# EAGLE design VCF-LM324-Stereo+LFO-POT2x3 (EAGLE 7.2.0)
Voltage-Controlled Low-Pass Filter with LFO using LM324 Quad-Opamp (Stereo) http://electro-music.com/forum/topic-45231-0.html&postdays=0&postorder=asc&highlight=
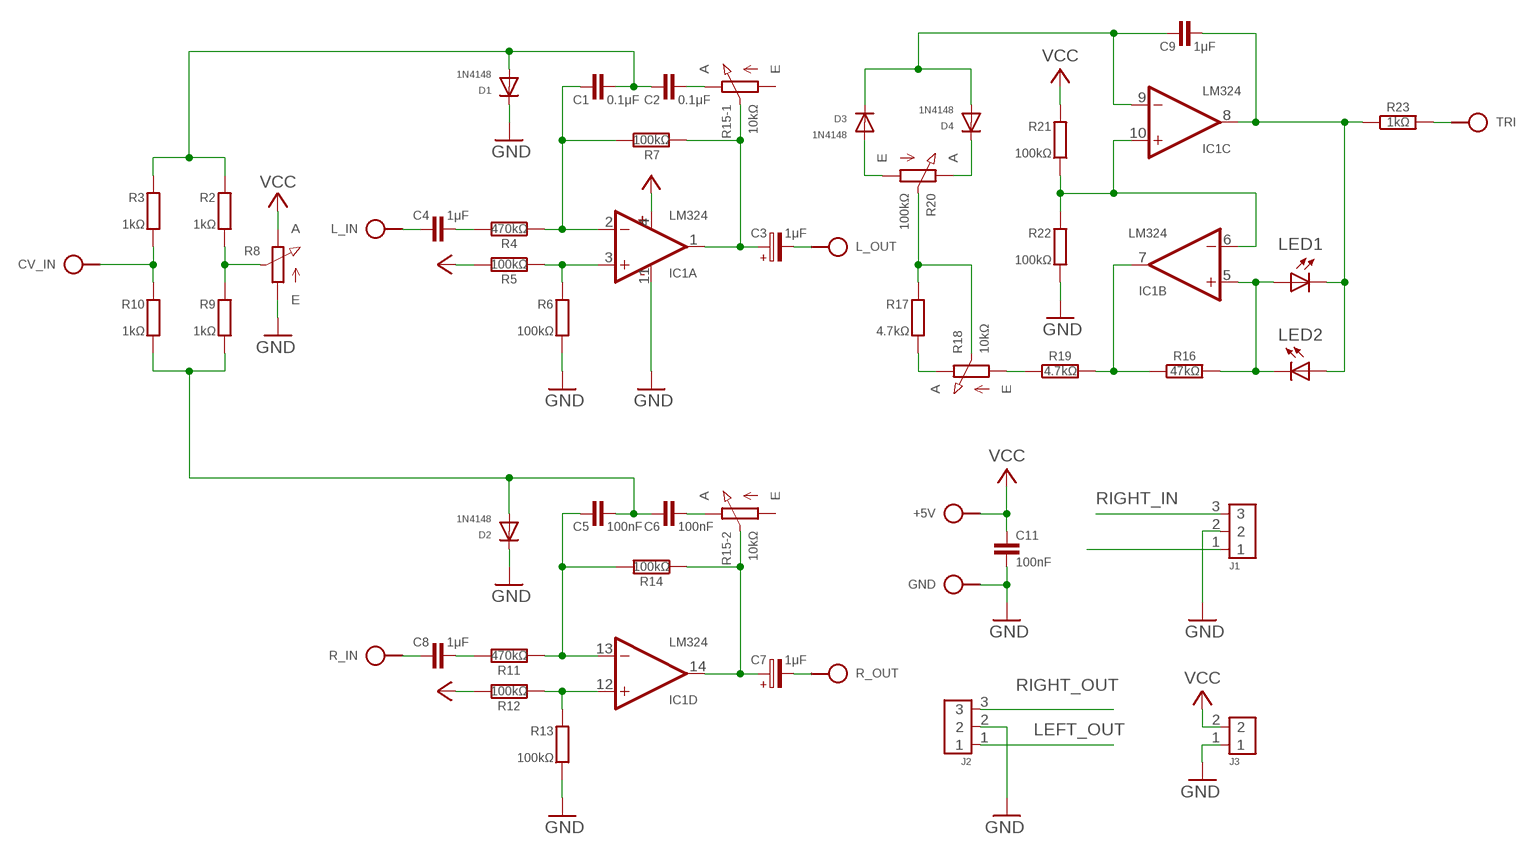
[diagram p0: schematic, sheet 1]

## Parts
+5V  VCC  SPAD  [SPAD]
C1  0.1μF  C-H075-020X044/V  [C075-020X044/V]
C2  0.1μF  C-H050-020X044  [C050-020X044]
C3  1μF  CPOL-HE2,5-3/V  [E2,5-3/V]
C4  1μF  C-H050-020X044  [C050-020X044]
C5  100nF  C-H050-020X044  [C050-020X044]
C6  100nF  C-H050-020X044  [C050-020X044]
C7  1μF  CPOL-HE2,5-3/V  [E2,5-3/V]
C8  1μF  C-H050-020X044  [C050-020X044]
C9  1μF  C-H050-024X044  [C050-024X044]
C11  100nF  C050-020X044  [C050-020X044]
CV_IN  CV_IN  SPAD  [SPAD]
D1  1N4148  1N414834-7V  [DO34-7V]
D2  1N4148  1N414834-7V  [DO34-7V]
D3  1N4148  1N414834-7V  [DO34-7V]
D4  1N4148  1N414834-7V  [DO34-7V]
GND  GND  SPAD  [SPAD]
IC1  LM324  LM324N  [DIL14]
J1  A_IN  CONN-3P-3P  [CONN-3P]
J2  A_OUT  CONN-3P-3P  [CONN-3P]
J3  CONN-2P2P/H  [CONN-2P]
L_IN  AUDIO_IN  SPAD  [SPAD]
L_OUT  AUDIO_OUT  SPAD  [SPAD]
LED1  LED3MM  [LED3MM]
LED2  LED3MM  [LED3MM]
R2  1kΩ  R0204V  [0204V]
R3  1kΩ  R0204/7  [0204/7]
R4  470kΩ  R-H0204/10-V  [0204/10-V]
R5  100kΩ  R-H0204/2V  [0204/2V]
R6  100kΩ  R0204/10  [0204/10]
R7  100kΩ  R0204/7-V  [0204/7-V]
R8  POT-P5  [POT-P5]
R9  1kΩ  R0204/10  [0204/10]
R10  1kΩ  R0204/10  [0204/10]
R11  470kΩ  R-H0204/15  [0204/15]
R12  100kΩ  R-H0204/7-V  [0204/7-V]
R13  100kΩ  R0202V  [0202V]
R14  100kΩ  R-H0204/2V  [0204/2V]
R15  10kΩ  POT-STEREO  [POT-STEREO-2X3]
R16  47kΩ  R-H0204/10  [0204/10]
R17  4.7kΩ  R0204/10  [0204/10]
R18  10kΩ  POT  [POT]
R19  4.7kΩ  R-H0204/10-V  [0204/10-V]
R20  100kΩ  POT  [POT]
R21  100kΩ  R0204/10-V  [0204/10-V]
R22  100kΩ  R0204/2V  [0204/2V]
R23  1kΩ  R-H0204/10  [0204/10]
R_IN  AUDIO_IN  SPAD  [SPAD]
R_OUT  AUDIO_OUT  SPAD  [SPAD]
TRI  TRIANGLE  SPAD  [SPAD]

## Nets
GND: C11.2 D1.C D2.C GND.1 IC1.11(P:V-) J1.2 J2.2 J3.1 R6.1 R8.A R13.1 R22.1
LEFT_IN: C4.1 J1.1 L_IN.1
LEFT_OUT: C3.- J2.1 L_OUT.1
N$1: C6.2 R15.2-E(-2:E)
N$2: C1.1 IC1.2(A:-IN) R4.1 R7.1
N$3: C2.2 R15.1-E(-1:E)
N$4: C3.+ IC1.1(A:OUT) R7.2 R15.1-S(-1:S)
N$5: R2.1 R8.S R9.2
N$7: IC1.3(A:+IN) R5.1 R6.2
N$8: CV_IN.1 R3.1 R10.2
N$9: C1.2 C2.1 D1.A R2.2 R3.2
N$10: C4.2 R4.2
N$12: C7.+ IC1.14(D:OUT) R14.1 R15.2-S(-2:S)
N$13: IC1.12(D:+IN) R12.1 R13.2
N$14: IC1.7(B:OUT) R16.1 R19.2
N$15: IC1.5(B:+IN) LED1.A LED2.K(C) R16.2
N$16: C5.2 C6.1 D2.A R9.1 R10.1
N$17: C5.1 IC1.13(D:-IN) R11.1 R14.2
N$20: C8.2 R11.2
N$26: C9.1 D3.C D4.A IC1.9(C:-IN)
N$28: C9.2 IC1.8(C:OUT) LED1.K(C) LED2.A R23.1
OA_C_IN+: IC1.6(B:-IN) IC1.10(C:+IN) R21.2 R22.2
RIGHT_IN: C8.1 J1.3 R_IN.1
RIGHT_OUT: C7.- J2.3 R_OUT.1
TRI_OUT: R23.2 TRI.1
TRIM_1_A: D3.A R20.1(A)
TRIM_1_B: D4.C R20.3(E)
TRIM_2_A: R17.1 R18.3(E)
TRIM_2_B: R18.1(A) R19.1
TRIM_P: R17.2 R18.2(S) R20.2(S)
VCC: +5V.1 C11.1 IC1.4(P:V+) J3.2 R5.2 R8.E R12.2 R21.1
Unconnected: R15.1-A(-1:A) R15.2-A(-2:A)

## Library data of the parts
+5V CV_IN GND L_IN L_OUT R_IN R_OUT TRI = pad:SPAD
C1 C2 C4-C6 C8 C9 = c:C-H
C3 C7 = c:CPOL-H
C11 = c:C: CAPACITOR, European symbol
D1-D4 = d:1N4148
IC1 = ic:LM324: OP AMP
J1 J2 = pinconn:CONN-3P
J3 = pinconn:CONN-2P
LED1 LED2 = led:LED: LED OSRAM: - CHIPLED LG R971, LG N971, LY N971, LG Q971, LY Q971, LO R971, LY R971 LH N974, LH R974 LS Q976, LO Q976, LY Q976 LO Q996 - Hyper CHIPLED LW Q18S LB Q993, LB Q99A, LB R99A - SideLED LS A670, LO A670, LY A670, LG A670, LP A670 LB A673, LV A673, LT A673, LW A673 LH A674 LY A675 LS A676, LA A676, LO A676, LY A676, LW A676 LS A679, LY A679, LG A679 - Hyper Micro SIDELED@@ LS Y876, LA Y876, LO Y876, LY Y876 LT Y87S - SmartLED LW L88C, LW L88S LB L89C, LB L89S, LG L890 LS L89K, LO L89K, LY L89K LS L896, LA L896, LO L896, LY L896 - TOPLED LS T670, LO T670, LY T670, LG T670, LP T670 LSG T670, LSP T670, LSY T670, LOP T670, LYG T670 LG T671, LOG T671, LSG T671 LB T673, LV T673, LT T673, LW T673 LH T674 LS T676, LA T676, LO T676, LY T676, LB T676, LH T676, LSB T676, LW T676 LB T67C, LV T67C, LT T67C, LS T67K, LO T67K, LY T67K, LW E67C LS E67B, LA E67B, LO E67B, LY E67B, LB E67C, LV E67C, LT E67C LW T67C LS T679, LY T679, LG T679 LS T770, LO T770, LY T770, LG T770, LP T770 LB T773, LV T773, LT T773, LW T773 LH T774 LS E675, LA E675, LY E675, LS T675 LS T776, LA T776, LO T776, LY T776, LB T776 LHGB T686 LT T68C, LB T68C - Hyper Mini TOPLED@@ LB M676 - Mini TOPLED Santana@@ LG M470 LS M47K, LO M47K, LY M47K Source: http://www.osram.convergy.de LUXEON: - LUMILED@@ LXK2-PW12-R00, LXK2-PW12-S00, LXK2-PW14-U00, LXK2-PW14-V00 LXK2-PM12-R00, LXK2-PM12-S00, LXK2-PM14-U00 LXK2-PE12-Q00, LXK2-PE12-R00, LXK2-PE12-S00, LXK2-PE14-T00, LXK2-PE14-U00 LXK2-PB12-K00, LXK2-PB12-L00, LXK2-PB12-M00, LXK2-PB14-N00, LXK2-PB14-P00, LXK2-PB14-Q00 LXK2-PR12-L00, LXK2-PR12-M00, LXK2-PR14-Q00, LXK2-PR14-R00 LXK2-PD12-Q00, LXK2-PD12-R00, LXK2-PD12-S00 LXK2-PH12-R00, LXK2-PH12-S00 LXK2-PL12-P00, LXK2-PL12-Q00, LXK2-PL12-R00 Source: www.luxeon.com KINGBRIGHT: KA-3528ASYC Source: www.kingbright.com
R2 R3 R6 R7 R9 R10 R13 R17 R21 R22 = r:R: RESISTOR, European symbol
R4 R5 R11 R12 R14 R16 R19 R23 = r:R-H
R8 R18 R20 = r:POT
R15 = r:POT-STEREO

## Module LFO
Ports: TRI_OUT(io) GND(io) VCC(io)

### Library data of the parts

## Module VCF-L
Ports: 

### Library data of the parts

## Board
Voltage-Controlled Low-Pass Filter with LFO using LM324 Quad-Opamp (Stereo) http://electro-music.com/forum/topic-45231-0.html&postdays=0&postorder=asc&highlight=
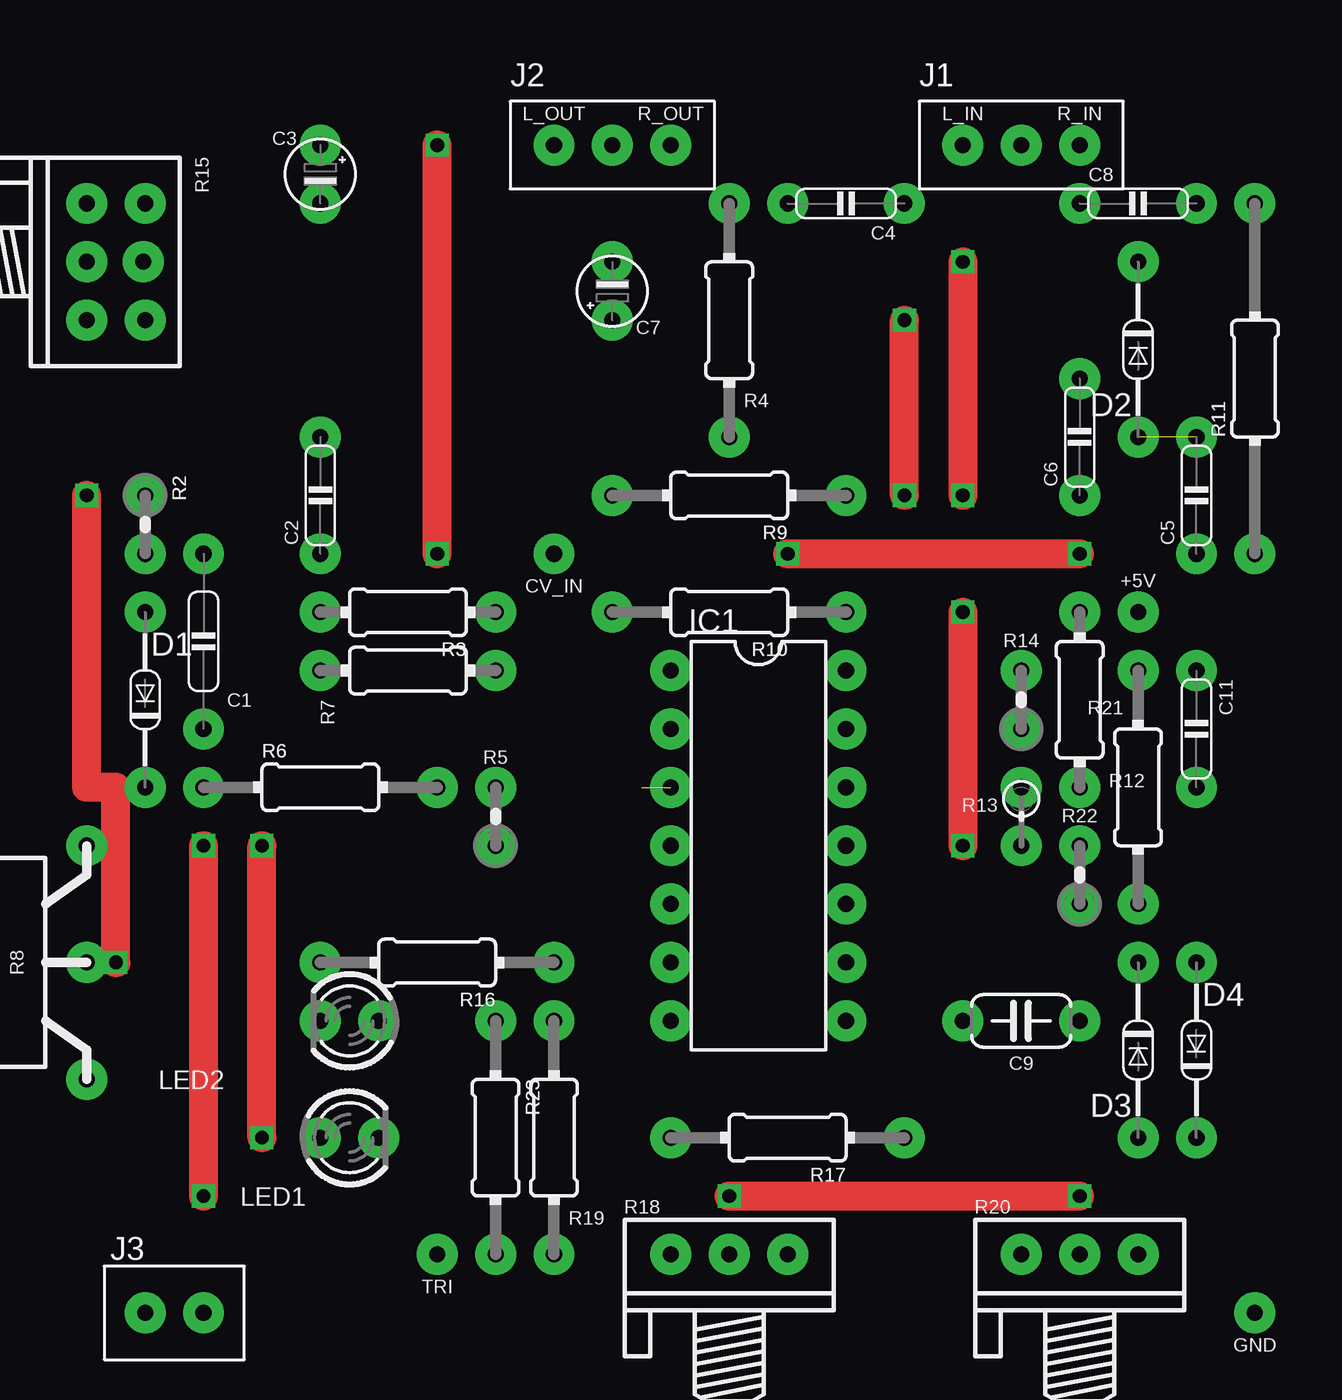
[diagram p1: board, top side]
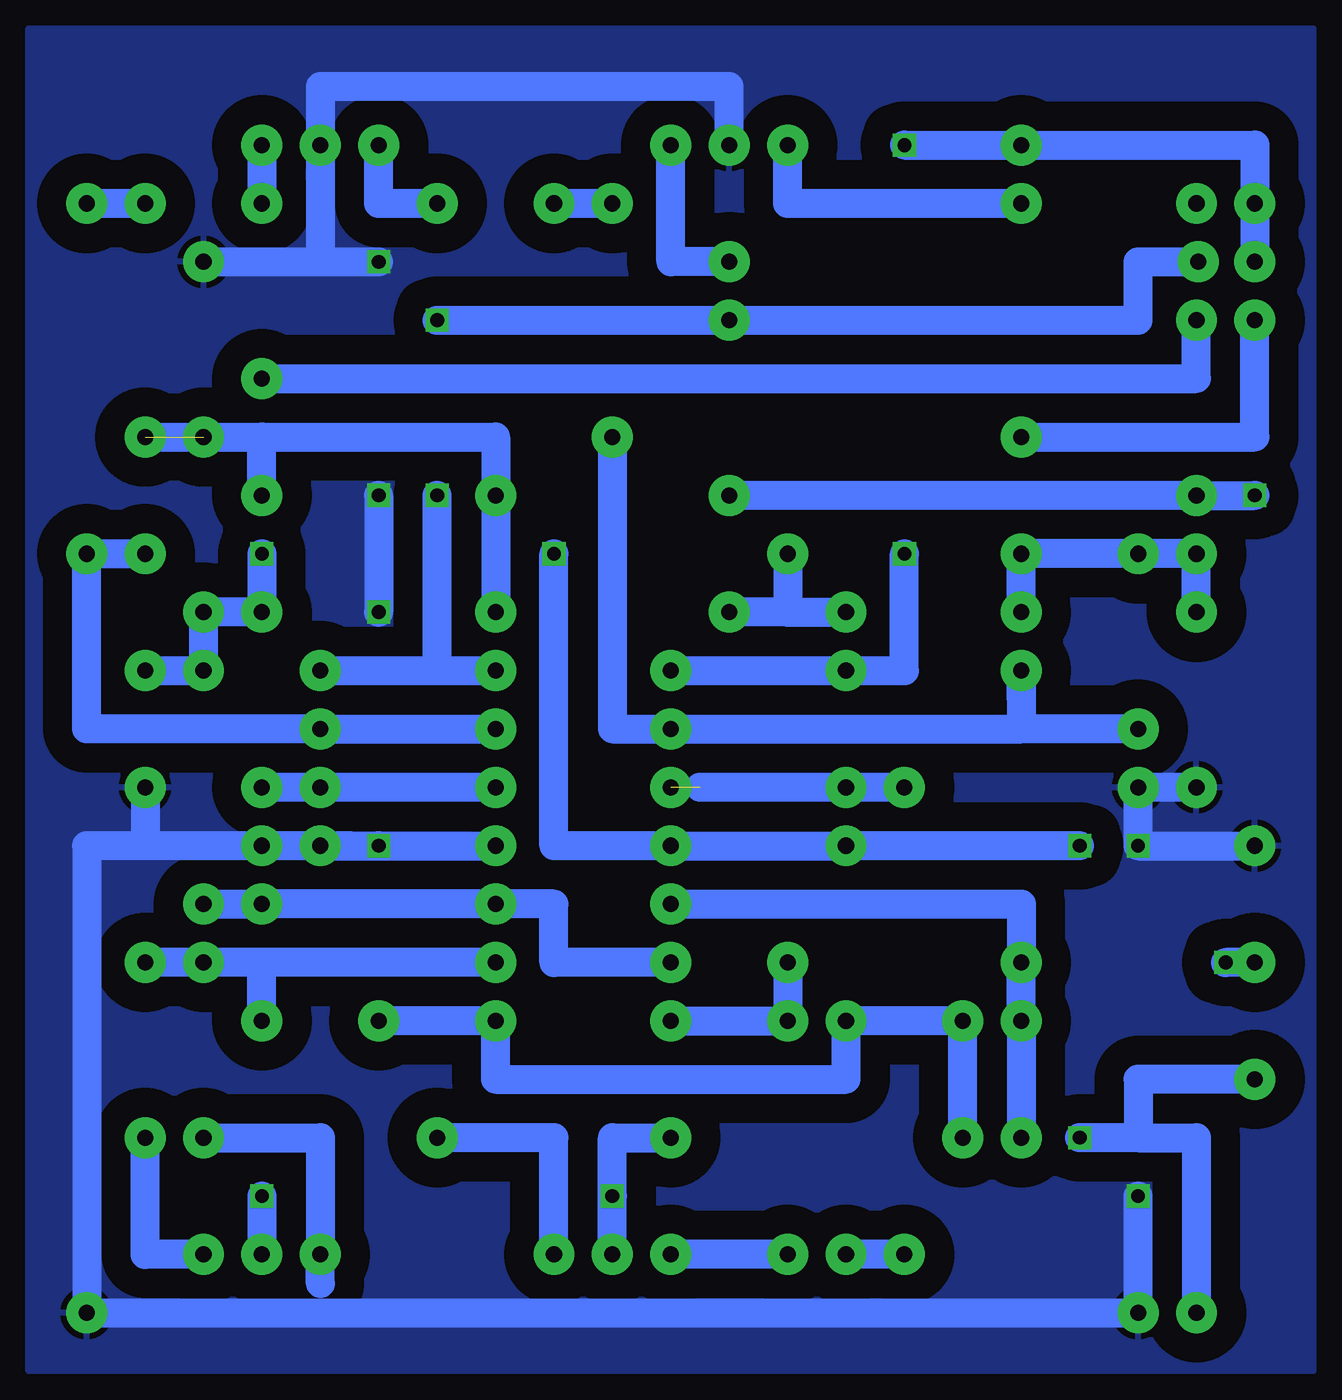
[diagram p2: board, bottom side, seen from below]

No outline drawn. Coordinates in mm, seen from the top.
Copper layers (1*16): Top 0.035mm / dielectric 1.5mm / Bottom 0.035mm
Design rules "default *": minimum track width 10mil, minimum drill 24mil, track to track 8mil, track to pad 8mil, pad to pad 8mil, via to via 8mil, smd to smd 8mil, copper to edge 40mil, drill to drill 8mil, minimum pad ring 10mil, minimum via ring 8mil, stop-mask expansion 0mil, vias tented up to drill 0mil, thermal gap 10mil

### Footprints (pad centres in the part's own frame; a part is rotated, then mirrored left to right if it is on the bottom)
SPAD = drill 0.7 pad 1.778: 1 0,0
C075-020X044/V = drill 0.7 pad 1.778: 1 0,3.81; 2 0,-3.81
C050-020X044 = drill 0.7 pad 1.778: 1 -2.54,0; 2 2.54,0
E2,5-3/V = drill 0.7 pad 1.778: + 0,1.27; - 0,-1.27
C050-024X044 = drill 0.7 pad 1.778: 1 -2.54,0; 2 2.54,0
DO34-7V = drill 0.7 pad 1.778: A 0,3.81; C 0,-3.81
DIL14 = drill 0.7 pad 1.778: 1 -3.81,7.62; 2 -3.81,5.08; 3 -3.81,2.54; 4 -3.81,0; 5 -3.81,-2.54; 6 -3.81,-5.08; 7 -3.81,-7.62; 8 3.81,-7.62; 9 3.81,-5.08; 10 3.81,-2.54; 11 3.81,0; 12 3.81,2.54; 13 3.81,5.08; 14 3.81,7.62
CONN-3P = drill 0.7 pad 1.778: 1 0,0; 2 2.54,0; 3 5.08,0
CONN-2P = drill 0.7 pad 1.778: 1 0,0; 2 -2.54,0
LED3MM = drill 0.7 pad 1.778: A -1.27,0; K 1.27,0
0204V = drill 0.7 pad 1.778: 1 -1.27,0; 2 1.27,0
0204/7 = drill 0.7 pad 1.778: 1 -3.81,0; 2 3.81,0
0204/10-V = drill 0.7 pad 1.778: 1 0,5.08; 2 0,-5.08
0204/2V = drill 0.7 pad 1.778: 1 0,1.27; 2 0,-1.27
0204/10 = drill 0.7 pad 1.778: 1 -5.08,0; 2 5.08,0
0204/7-V = drill 0.7 pad 1.778: 1 0,3.81; 2 0,-3.81
POT-P5 = drill 0.7 pad 1.778: A -5.08,2.54; E 5.08,2.54; S 0,2.54
0204/15 = drill 0.7 pad 1.778: 1 -7.62,0; 2 7.62,0
0202V = drill 0.7 pad 1.778: 1 0,-1.27; 2 0,1.27
POT-STEREO-2X3 = drill 0.7 pad 1.778: 1-A -2.54,-2.54; 1-E 2.54,-2.54; 1-S 0,-2.54; 2-A -2.54,0; 2-E 2.54,0; 2-S 0,-0.08
POT = drill 0.7 pad 1.778: 1 -2.54,0; 2 0,0; 3 2.54,0

### Placement (x,y rotation side)
+5V  50.8,33.02 270 top
C1  10.16,31.75 180 top
C2  15.24,38.1 90 top
C3  15.24,52.07 0 top
C4  38.1,50.8 180 top
C5  53.34,38.1 90 top
C6  48.26,40.64 90 top
C7  27.94,46.99 180 top
C8  50.8,50.8 0 top
C9  45.72,15.24 180 top
C11  53.34,27.94 270 top
CV_IN  25.4,35.56 90 top
D1  7.62,29.21 0 top
D2  50.8,44.45 180 top
D3  50.8,13.97 180 top
D4  53.34,13.97 0 top
GND  55.88,2.54 90 top
IC1  34.29,22.86 0 top
J1  43.18,53.34 0 top
J2  25.4,53.34 0 top
J3  10.16,2.54 0 top
L_IN  43.18,53.34 270 top
L_OUT  25.4,53.34 270 top
LED1  16.51,10.16 0 top
LED2  16.51,15.24 180 top
R2  7.62,36.83 270 top
R3  19.05,33.02 180 top
R4  33.02,45.72 180 top
R5  22.86,24.13 0 top
R6  15.24,25.4 0 top
R7  19.05,30.48 90 top
R8  2.54,17.78 270 top
R9  33.02,38.1 180 top
R10  33.02,33.02 180 top
R11  55.88,43.18 90 top
R12  48.26,29.21 180 top
R13  45.72,24.13 0 top
R14  45.72,29.21 0 top
R15  7.62,48.26 270 top
R16  20.32,17.78 180 top
R17  35.56,10.16 180 top
R18  33.02,5.08 0 top
R19  25.4,10.16 180 top
R20  48.26,5.08 0 top
R21  50.8,25.4 0 top
R22  48.26,21.59 0 top
R23  22.86,10.16 270 top
R_IN  48.26,53.34 270 top
R_OUT  30.48,53.34 270 top
TRI  20.32,5.08 90 top

### Tracks (layer width: path | path; a pad name or v marks a point on that pad's centre or on a via)
GND  (via drill 0.6)
  Top 1.27: v10.16,7.62 v10.16,22.86 | v43.18,48.26 v43.18,38.1 | v43.18,33.02 v43.18,22.86
  Bottom 1.27: 44.45,22.86 R13.1 | R13.1 v43.18,22.86 IC1.11 | R13.1 R22.1 53.34,22.86 | v10.16,7.62 J3.1 GND.1 55.88,22.86 53.34,22.86 | R8.A v10.16,22.86 R6.1 D1.C | J2.2 27.94,55.88 45.72,55.88 J1.2 45.72,48.26 | 45.72,48.26 v43.18,48.26 | v43.18,38.1 v43.18,33.02 | C11.2 53.34,22.86 | D2.C 45.72,48.26
  pour Bottom (isolate 1.27): 2.54,58.42 2.54,0 58.42,0 58.42,58.42
LEFT_IN
  Bottom 1.27: C4.1 43.18,50.8 J1.1
LEFT_OUT
  Bottom 1.27: C3.- 25.4,50.8 L_OUT.1
N$1
  Bottom 1.27: C6.2 7.62,43.18 R15.2-E
N$2
  Bottom 1.27: 15.24,27.94 IC1.2 33.02,27.94 R4.1 | C1.1 15.24,27.94 | 15.24,27.94 R7.1 15.24,29.21
N$3
  Bottom 1.27: C2.2 5.08,40.64 R15.1-E
N$4  (via drill 0.6)
  Top 1.27: v20.32,35.56 v20.32,53.34
  Bottom 1.27: IC1.1 R7.2 20.32,30.48 v20.32,35.56 | v20.32,53.34 C3.+ 5.08,53.34 R15.1-S
N$5  (via drill 0.6)
  Top 1.27: v6.35,17.78 6.35,25.4 5.08,25.4 v5.08,38.1
  Bottom 1.27: R8.S v6.35,17.78 | R9.2 R2.1 v5.08,38.1
N$7  (1 unrouted)
  Bottom 1.27: R6.2 R5.1 29.21,25.4
N$8
  Bottom 1.27: 25.4,33.02 R10.2 | CV_IN.1 25.4,33.02 | 25.4,33.02 R3.1
N$9
  Bottom 1.27: D1.A R2.2 C1.2 C2.1 R3.2
N$10
  Bottom 1.27: R4.2 C4.2
N$12  (via drill 0.6)
  Top 1.27: v40.64,38.1 v40.64,45.72
  Bottom 1.27: IC1.14 R14.1 40.64,30.48 v40.64,38.1 | C7.+ v40.64,45.72 10.16,45.72 10.16,48.26 7.62,48.26
N$13
  Bottom 1.27: IC1.12 R13.2 R12.1
N$14
  Bottom 1.27: R16.1 R19.2 IC1.7
N$15
  Bottom 1.27: IC1.5 15.24,20.32 R16.2 LED2.K LED1.A
N$16  (1 unrouted)
  Bottom 1.27: R10.1 R9.1 38.1,40.64 48.26,40.64 | C5.2 48.26,40.64 | C6.1 48.26,40.64
N$17
  Bottom 1.27: IC1.13 R14.2 55.88,27.94 R11.1 C5.1
N$20
  Bottom 1.27: C8.2 R11.2
N$26
  Bottom 1.27: IC1.9 48.26,17.78 | C9.1 48.26,17.78 | 48.26,17.78 D3.C D4.A
N$28
  Bottom 1.27: LED1.K LED2.A R23.1 22.86,12.7 38.1,12.7 IC1.8 C9.2
OA_C_IN+
  Bottom 1.27: IC1.6 35.56,17.78 35.56,20.32 IC1.10 R22.2 R21.2
RIGHT_IN
  Bottom 1.27: J1.3 C8.1
RIGHT_OUT
  Bottom 1.27: C7.- 30.48,48.26 R_OUT.1
TRI_OUT
  Bottom 1.27: TRI.1 R23.2
TRIM_1_A
  Bottom 1.27: D3.A 45.72,10.16 R20.1 45.72,3.81
TRIM_1_B
  Bottom 1.27: R20.3 53.34,5.08 D4.C
TRIM_2_A
  Bottom 1.27: R18.3 35.56,10.16 R17.1
TRIM_2_B
  Bottom 1.27: R19.1 R18.1
TRIM_P  (via drill 0.6)
  Top 1.27: v33.02,7.62 v48.26,7.62
  Bottom 1.27: R17.2 33.02,10.16 v33.02,7.62 R18.2 | v48.26,7.62 R20.2
VCC  (via drill 0.6)
  Top 1.27: v12.7,10.16 v12.7,22.86 | v35.56,35.56 v48.26,35.56
  Bottom 1.27: C11.1 R21.1 +5V.1 R12.2 v48.26,35.56 | 10.16,10.16 10.16,12.7 R8.E | J3.2 7.62,10.16 10.16,10.16 | 10.16,10.16 v12.7,10.16 | v12.7,22.86 R5.2 IC1.4 35.56,22.86 v35.56,35.56

### Text on the board
tDocu: LFO freq | LFO duty
Contour: 23 | 22 | 21 | 20 | 19 | 18 | 17 | 16 | 15 | 14 | 13 | 12 | 11 | 10 | 9 | 8 | 7 | 6 | 5 | 4 | 3 | 2 | 1 | 1 | 2 | 3 | 4 | 5 | 6 | 7 | 8 | 9 | 10 | 11 | 12 | 13 | 14 | 15 | 16 | 17 | 18 | 19 | 20 | 21